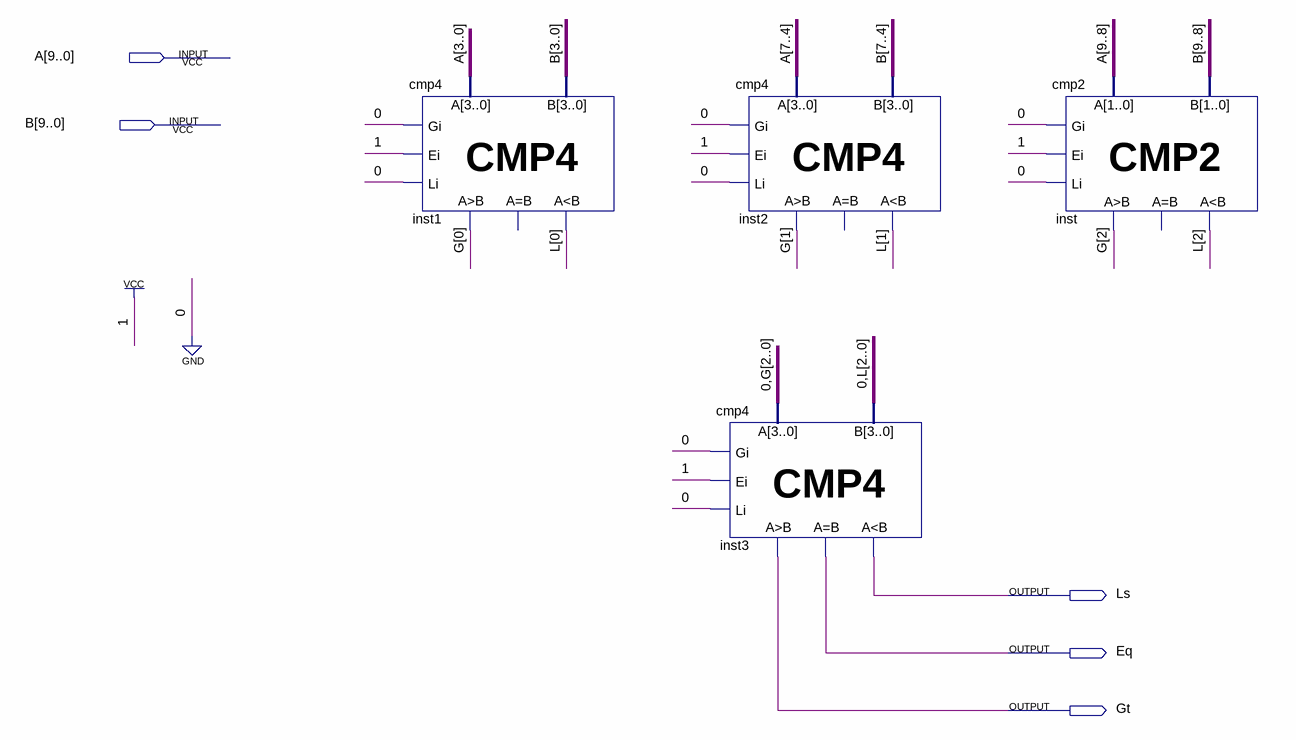
[diagram p0: schematic sheet]
// Quartus schematic cmp10.bdf as structural Verilog: 4 symbols, 5 pins
module cmp10 (
  input  [9:0] A,
  input  [9:0] B,
  output Ls,
  output Eq,
  output Gt
);

  wire [2:0] G, L;

  cmp4 inst1 (.A(A[3:0]), .B(B[3:0]), .Gi(1'b0), .Ei(1'b1), .Li(1'b0), .Gi_1(G[0]), .Li_1(L[0]));  // open: Ei_1
  cmp4 inst2 (.A(A[7:4]), .B(B[7:4]), .Gi(1'b0), .Ei(1'b1), .Li(1'b0), .Gi_1(G[1]), .Li_1(L[1]));  // open: Ei_1
  cmp4 inst3 (.A({1'b0, G}), .B({1'b0, L}), .Gi(1'b0), .Ei(1'b1), .Li(1'b0), .Gi_1(Gt), .Ei_1(Eq), .Li_1(Ls));
  cmp2 inst (.A(A[9:8]), .B(B[9:8]), .Gi(1'b0), .Ei(1'b1), .Li(1'b0), .Gi_1(G[2]), .Li_1(L[2]));  // open: Ei_1
endmodule
